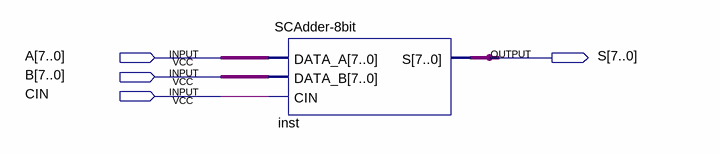
[diagram p0: schematic sheet]
// Quartus schematic SCADDER_TEST.bdf as structural Verilog: 1 symbols, 4 pins
module SCADDER_TEST (
  input  [7:0] A,
  input  [7:0] B,
  input  CIN,
  output [7:0] S
);

  \SCAdder-8bit  inst (.DATA_A(A), .DATA_B(B), .CIN(CIN), .S(S));
endmodule
